# EAGLE design main_v3-bez_dzielnika (EAGLE 5.10)
TME: 1206YC106KAT2A

## Sheet 1 of 5
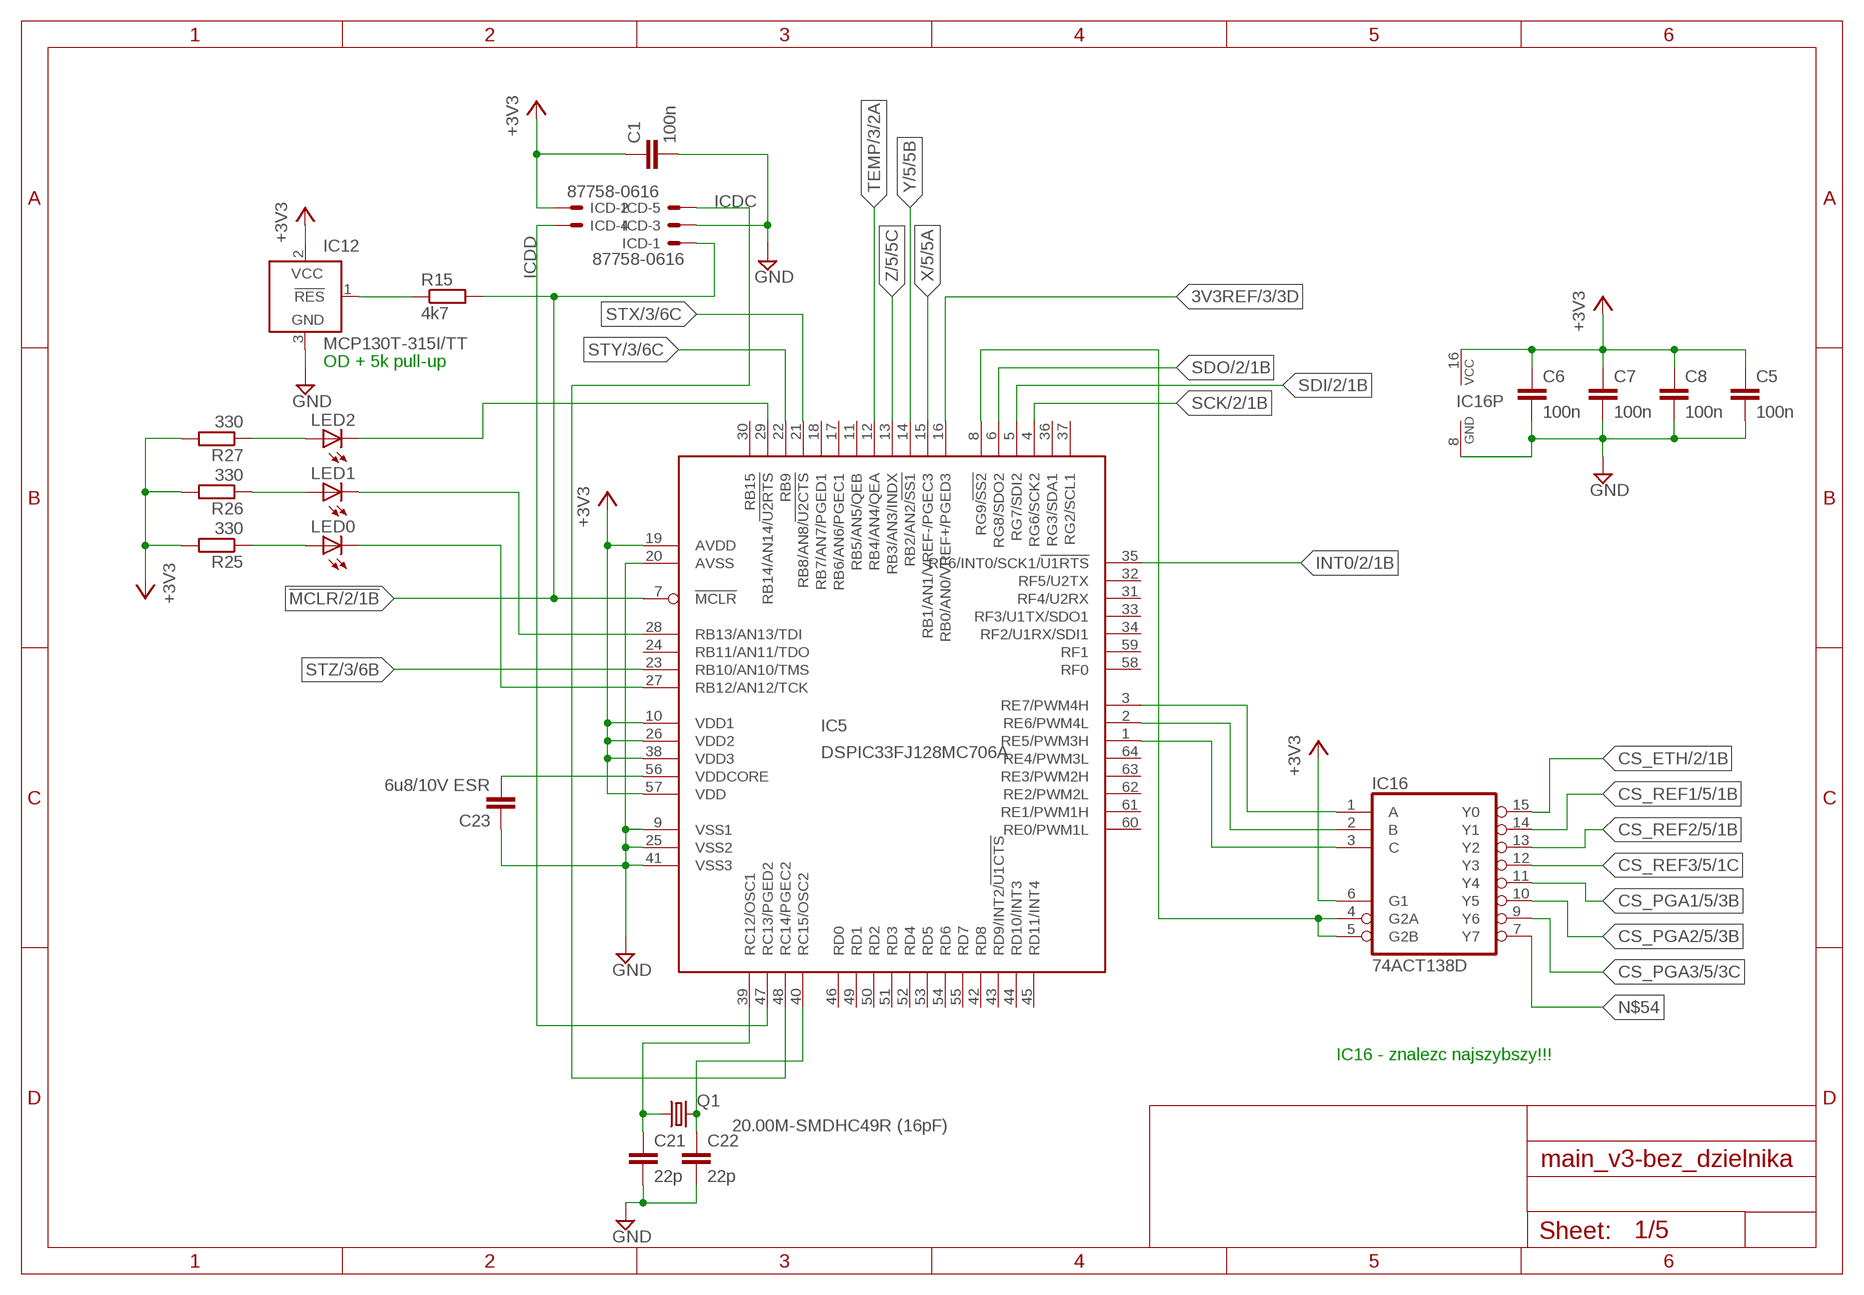
[diagram p0: schematic, sheet 1]

### Parts
C1  100n  C-EUC0805  [C0805]
C5  100n  C-EUC0805  [C0805]
C6  100n  C-EUC0805  [C0805]
C7  100n  C-EUC0805  [C0805]
C8  100n  C-EUC0805  [C0805]
C21  22p  C-EUC0805  [C0805]
C22  22p  C-EUC0805  [C0805]
C23  6u8/10V ESR  C-EUC1210  [C1210]
IC5  DSPIC33FJ128MC706A  DSPIC33FJ128MC706  [TQFP64_10X10]
IC12  MCP130T-315I/TT  MCP10T  [SOT23B-3]
IC16  74ACT138D  [SO16]
ICD  87758-0616  [87758-0616]
LED0  LEDCHIPLED_1206  [CHIPLED_1206]
LED1  LEDCHIPLED_1206  [CHIPLED_1206]
LED2  LEDCHIPLED_1206  [CHIPLED_1206]
Q1  20.00M-SMDHC49R (16pF)  CRYSTALHC49UP  [HC49UP]
R15  4k7  R-EU_R0805  [R0805]
R25  330  R-EU_R0805  [R0805]
R26  330  R-EU_R0805  [R0805]
R27  330  R-EU_R0805  [R0805]

### Nets
3V3REF: IC5.16(RB0/AN0/VREF+/PGED3) ; also sheet 3
!MCLR: IC5.7(!MCLR) ICD.1 R15.2 ; also sheet 2
+3V3: C1.1 C5.1 C6.1 C7.1 C8.1 IC5.10(VDD1) IC5.19(AVDD) IC5.26(VDD2) IC5.38(VDD3) IC5.57(VDD) IC12.2(VCC) IC16.6(G1) IC16.16(VCC) ICD.2 R25.2 R26.2 R27.2 ; also sheet 2,4,5
CS_ETH: IC16.15(Y0) ; also sheet 2
CS_PGA1: IC16.11(Y4) ; also sheet 5
CS_PGA2: IC16.10(Y5) ; also sheet 5
CS_PGA3: IC16.9(Y6) ; also sheet 5
CS_REF1: IC16.14(Y1) ; also sheet 5
CS_REF2: IC16.13(Y2) ; also sheet 5
CS_REF3: IC16.12(Y3) ; also sheet 5
GND: C1.2 C5.2 C6.2 C7.2 C8.2 C21.2 C22.2 C23.1 IC5.9(VSS1) IC5.20(AVSS) IC5.25(VSS2) IC5.41(VSS3) IC12.3(GND) IC16.8(GND) ICD.3 ; also sheet 2,3,4,5
ICDC: IC5.48(RC14/PGEC2) ICD.5
ICDD: IC5.47(RC13/PGED2) ICD.4
INT0: IC5.35(RF6/INT0/SCK1/!U1RTS) ; also sheet 2
LED0: IC5.27(RB12/AN12/TCK) LED0.C
LED1: IC5.28(RB13/AN13/TDI) LED1.C
LED2: IC5.29(RB14/AN14/!U2RTS) LED2.C
N$13: IC5.1(RE5/PWM3H) IC16.3(C)
N$43: IC5.8(RG9/!SS2) IC16.4(G2A) IC16.5(G2B)
N$46: C23.2 IC5.56(VDDCORE)
N$47: IC12.1(!RES) R15.1
N$48: C22.1 IC5.40(RC15/OSC2) Q1.2
N$49: C21.1 IC5.39(RC12/OSC1) Q1.1
N$54: IC16.7(Y7)
N$55: IC5.3(RE7/PWM4H) IC16.1(A)
N$56: IC5.2(RE6/PWM4L) IC16.2(B)
N$60: LED0.A R25.1
N$61: LED1.A R26.1
N$62: LED2.A R27.1
SCK: IC5.4(RG6/SCK2) ; also sheet 2
SDI: IC5.5(RG7/SDI2) ; also sheet 2,5
SDO: IC5.6(RG8/SDO2) ; also sheet 2,5
STX: IC5.21(RB8/AN8/!U2CTS) ; also sheet 3
STY: IC5.22(RB9) ; also sheet 3
STZ: IC5.23(RB10/AN10/TMS) ; also sheet 3
TEMP: IC5.12(RB4/AN4/QEA) ; also sheet 3
X: IC5.15(RB1/AN1/VREF-/PGEC3) ; also sheet 5
Y: IC5.14(RB2/AN2/!SS1) ; also sheet 5
Z: IC5.13(RB3/AN3/INDX) ; also sheet 5
Unconnected: IC5.11(RB5/AN5/QEB) IC5.17(RB6/AN6/PGEC1) IC5.18(RB7/AN7/PGED1) IC5.24(RB11/AN11/TDO) IC5.30(RB15) IC5.31(RF4/U2RX) IC5.32(RF5/U2TX) IC5.33(RF3/U1TX/SDO1) IC5.34(RF2/U1RX/SDI1) IC5.36(RG3/SDA1) IC5.37(RG2/SCL1) IC5.42(RD8) IC5.43(RD9/INT2/!U1CTS) IC5.44(RD10/INT3) IC5.45(RD11/INT4) IC5.46(RD0) IC5.49(RD1) IC5.50(RD2) IC5.51(RD3) IC5.52(RD4) IC5.53(RD5) IC5.54(RD6) IC5.55(RD7) IC5.58(RF0) IC5.59(RF1) IC5.60(RE0/PWM1L) IC5.61(RE1/PWM1H) IC5.62(RE2/PWM2L) IC5.63(RE3/PWM2H) IC5.64(RE4/PWM3L) ICD.6

### Notes on the sheet
- OD + 5k pull-up
- IC16 - znalezc najszybszy!!!

## Sheet 2 of 5
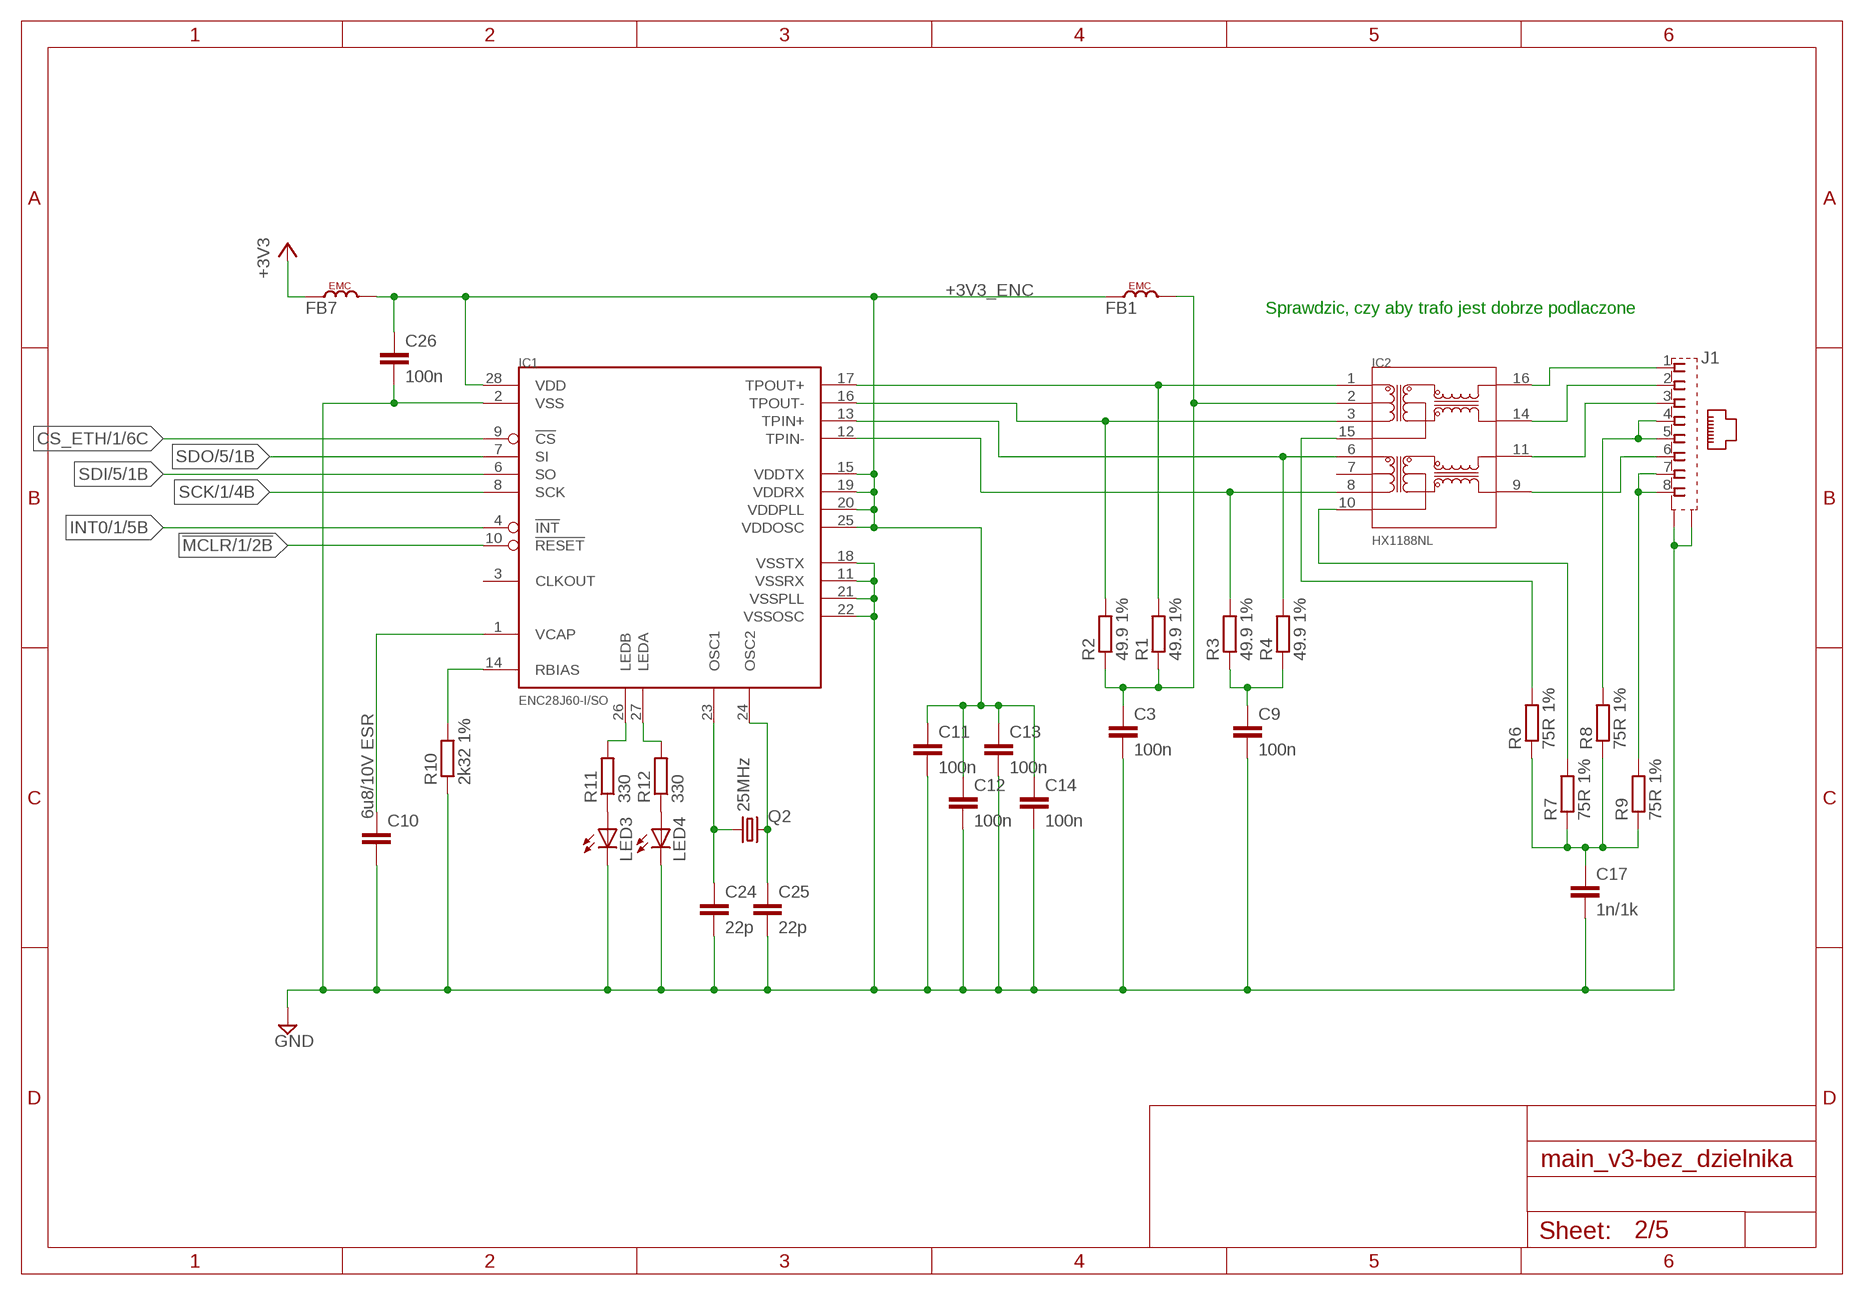
[diagram p1: schematic, sheet 2]

### Parts
C3  100n  C-EUC0805  [C0805]
C9  100n  C-EUC0805  [C0805]
C10  6u8/10V ESR  C-EUC1210  [C1210]
C11  100n  C-EUC0805  [C0805]
C12  100n  C-EUC0805  [C0805]
C13  100n  C-EUC0805  [C0805]
C14  100n  C-EUC0805  [C0805]
C17  1n/1k  C-EUC0805  [C0805]
C24  22p  C-EUC0805  [C0805]
C25  22p  C-EUC0805  [C0805]
C26  100n  C-EUC0805  [C0805]
FB1  FERRITE_BEAD0805  [R0805]
FB7  FERRITE_BEAD0805  [R0805]
IC1  ENC28J60-I/SO  [SO28W]
IC2  HX1188NL  [TRAFO_H*NL]
J1  555153-1  [555153-1]
LED3  LEDCHIPLED_1206  [CHIPLED_1206]
LED4  LEDCHIPLED_1206  [CHIPLED_1206]
Q2  25MHz  CRYSTALHC49UP  [HC49UP]
R1  49.9 1%  R-EU_M0805  [M0805]
R2  49.9 1%  R-EU_M0805  [M0805]
R3  49.9 1%  R-EU_M0805  [M0805]
R4  49.9 1%  R-EU_M0805  [M0805]
R6  75R 1%  R-EU_R0805  [R0805]
R7  75R 1%  R-EU_R0805  [R0805]
R8  75R 1%  R-EU_R0805  [R0805]
R9  75R 1%  R-EU_R0805  [R0805]
R10  2k32 1%  R-EU_0204/5  [0204/5]
R11  330  R-EU_R0805  [R0805]
R12  330  R-EU_R0805  [R0805]

### Nets
!MCLR: IC1.10(!RESET) ; also sheet 1
+3V3: FB7.1 ; also sheet 1,4,5
+3V3_ENC: C11.1 C12.1 C13.1 C14.1 C26.1 FB1.1 FB7.2 IC1.15(VDDTX) IC1.19(VDDRX) IC1.20(VDDPLL) IC1.25(VDDOSC) IC1.28(VDD)
CS_ETH: IC1.9(!CS) ; also sheet 1
GND: C3.2 C9.2 C10.2 C11.2 C12.2 C13.2 C14.2 C17.2 C24.2 C25.2 C26.2 IC1.2(VSS) IC1.11(VSSRX) IC1.18(VSSTX) IC1.21(VSSPLL) IC1.22(VSSOSC) J1.G1(S1) J1.G2(S2) LED3.C LED4.C R10.1 ; also sheet 1,3,4,5
INT0: IC1.4(!INT) ; also sheet 1
N$5: IC2.15 R6.2
N$6: C3.1 FB1.2 IC2.2 R1.1 R2.1
N$7: IC2.10 R7.2
N$8: C9.1 R3.1 R4.1
N$9: C17.1 R6.1 R7.1 R8.1 R9.1
N$14: J1.4 J1.5 R8.2
N$15: J1.7 J1.8 R9.2
N$16: C25.1 IC1.24(OSC2) Q2.2
N$17: C24.1 IC1.23(OSC1) Q2.1
N$18: IC1.14(RBIAS) R10.2
N$19: C10.1 IC1.1(VCAP)
N$22: LED3.A R11.1
N$23: LED4.A R12.1
N$24: IC1.26(LEDB) R11.2
N$25: IC1.27(LEDA) R12.2
SCK: IC1.8(SCK) ; also sheet 1
SDI: IC1.6(SO) ; also sheet 1,5
SDO: IC1.7(SI) ; also sheet 1,5
TPIN+1: IC1.13(TPIN+) IC2.6 R4.2
TPIN+2: IC2.11 J1.3
TPIN-1: IC1.12(TPIN-) IC2.8 R3.2
TPIN-2: IC2.9 J1.6
TPOUT+1: IC1.17(TPOUT+) IC2.1 R1.2
TPOUT+2: IC2.16 J1.1
TPOUT-1: IC1.16(TPOUT-) IC2.3 R2.2
TPOUT-2: IC2.14 J1.2
Unconnected: IC1.3(CLKOUT) IC2.7

### Notes on the sheet
- Sprawdzic, czy aby trafo jest dobrze podlaczone

## Sheet 3 of 5
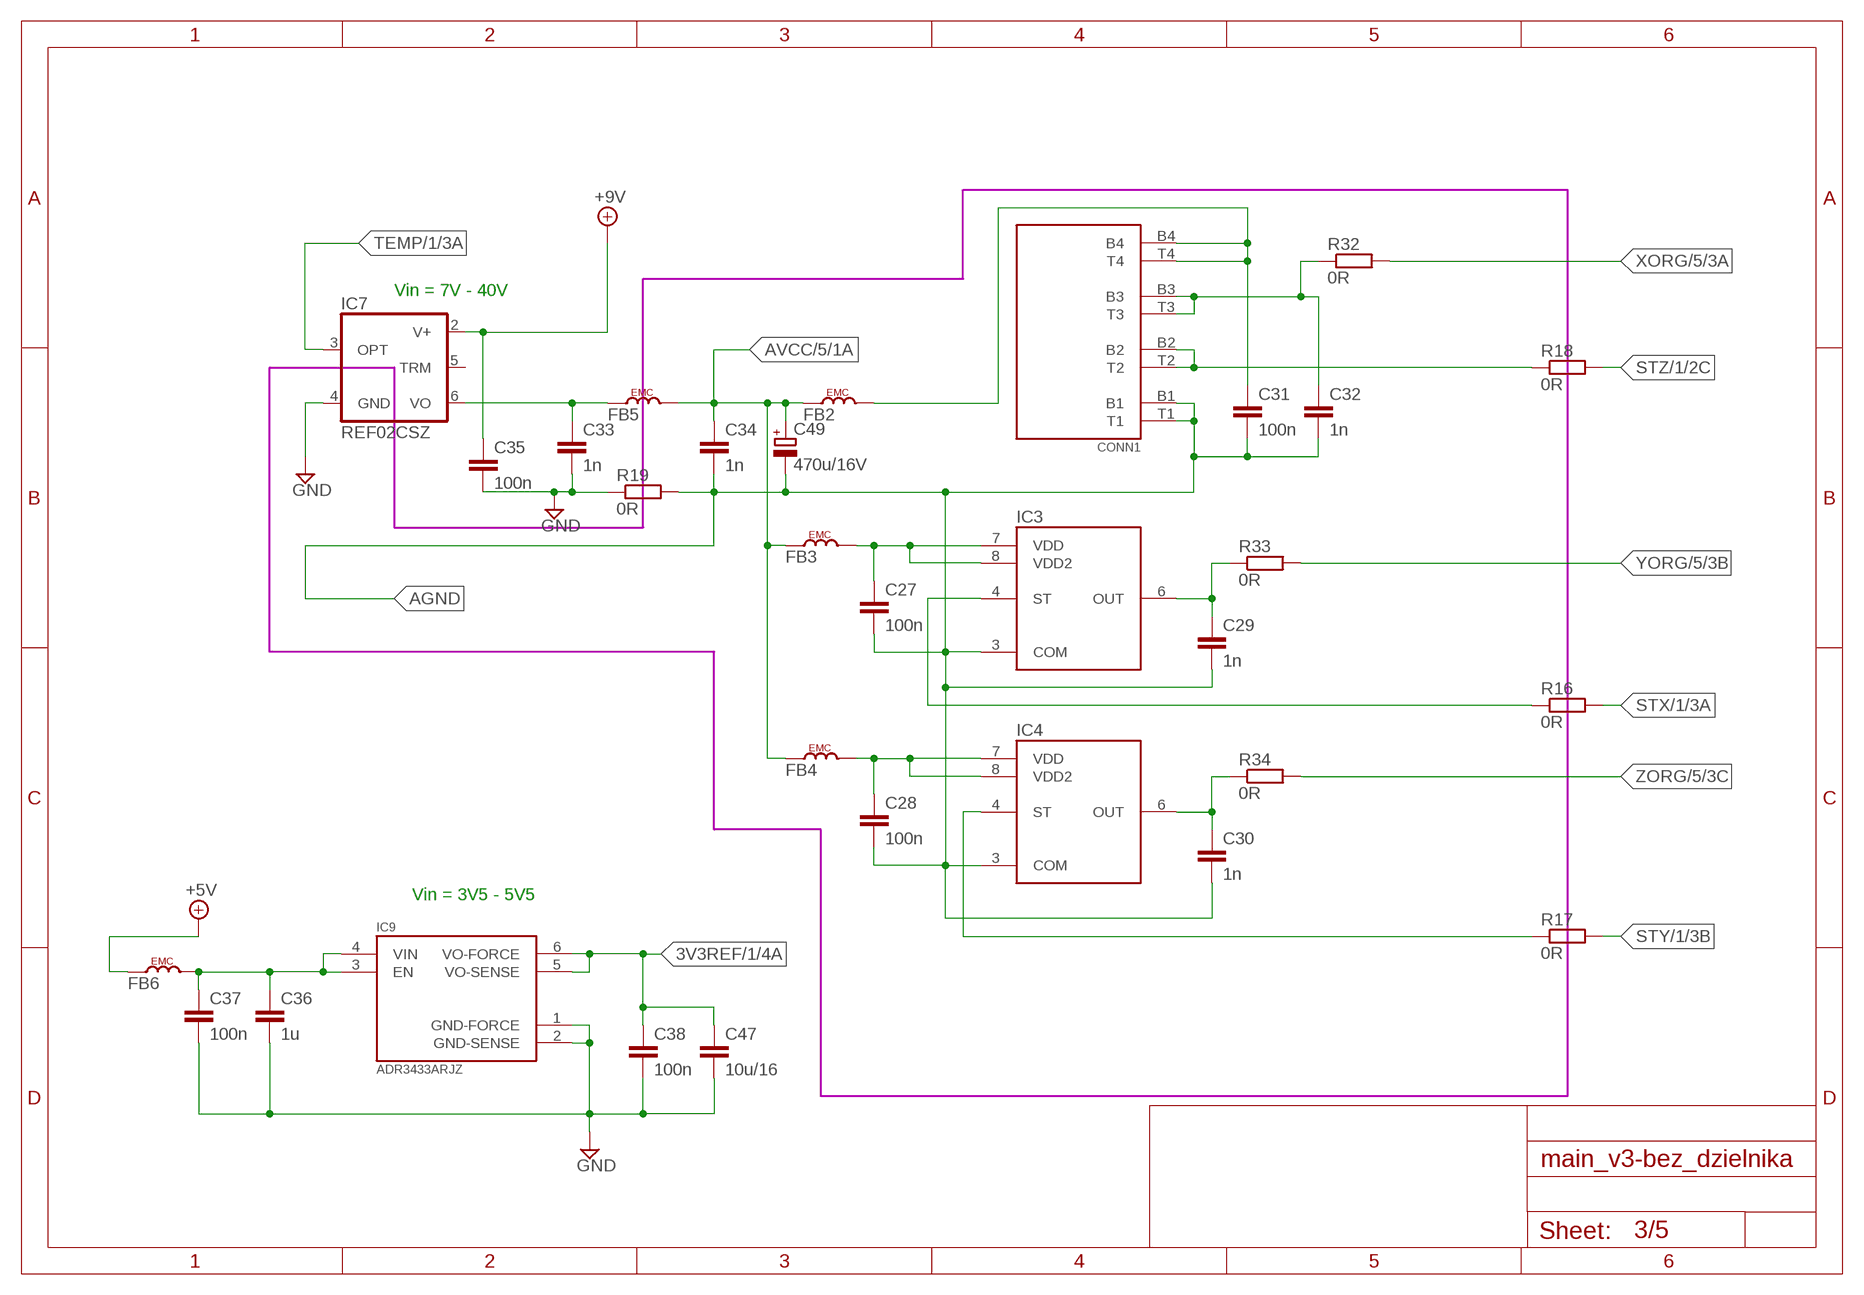
[diagram p2: schematic, sheet 3]

### Parts
C27  100n  C-EUC0805  [C0805]
C28  100n  C-EUC0805  [C0805]
C29  1n  C-EUC0805  [C0805]
C30  1n  C-EUC0805  [C0805]
C31  100n  C-EUC0805  [C0805]
C32  1n  C-EUC0805  [C0805]
C33  1n  C-EUC0805  [C0805]
C34  1n  C-EUC0805  [C0805]
C35  100n  C-EUC0805  [C0805]
C36  1u  C-EUC1206  [C1206]
C37  100n  C-EUC0805  [C0805]
C38  100n  C-EUC0805  [C0805]
C47  10u/16  C-EUC1206K  [C1206K]
C49  470u/16V  CPOL-EUE3.5-8  [E3,5-8]
CONN1  GNIAZDO4  [GNIAZDO]
FB2  FERRITE_BEAD0805  [R0805]
FB3  FERRITE_BEAD0805  [R0805]
FB4  FERRITE_BEAD0805  [R0805]
FB5  FERRITE_BEAD0805  [R0805]
FB6  FERRITE_BEAD0805  [R0805]
IC3  ADXL001-70  [LCC8]
IC4  ADXL001-70  [LCC8]
IC7  REF02CSZ  REF02D  [SO08]
IC9  ADR3433ARJZ  [SOT23-6]
R16  0R  R-EU_R0805  [R0805]
R17  0R  R-EU_R0805  [R0805]
R18  0R  R-EU_R0805  [R0805]
R19  0R  R-EU_R0805  [R0805]
R32  0R  R-EU_R0805  [R0805]
R33  0R  R-EU_R0805  [R0805]
R34  0R  R-EU_R0805  [R0805]

### Nets
3V3REF: C38.1 C47.1 IC9.5(VO-SENSE) IC9.6(VO-FORCE) ; also sheet 1
+5V: FB6.1 ; also sheet 4,5
+9V: C35.1 IC7.2(V+) ; also sheet 4
AGND: C27.2 C28.2 C29.2 C30.2 C31.2 C32.2 C34.2 C49.- CONN1.B1 CONN1.T1 IC3.3(COM) IC4.3(COM) R19.2
AVCC: C34.1 C49.+ FB2.1 FB3.1 FB4.1 FB5.2 ; also sheet 5
GND: C33.2 C35.2 C36.2 C37.2 C38.2 C47.2 IC7.4(GND) IC9.1(GND-FORCE) IC9.2(GND-SENSE) R19.1 ; also sheet 1,2,4,5
N$12: C36.1 C37.1 FB6.2 IC9.3(EN) IC9.4(VIN)
N$21: C27.1 FB3.2 IC3.7(VDD) IC3.8(VDD2)
N$26: C29.1 IC3.6(OUT) R33.1
N$27: C30.1 IC4.6(OUT) R34.1
N$28: CONN1.B2 CONN1.T2 R18.1
N$29: C32.1 CONN1.B3 CONN1.T3 R32.1
N$31: IC3.4(ST) R16.1
N$32: C31.1 CONN1.B4 CONN1.T4 FB2.2
N$33: C28.1 FB4.2 IC4.7(VDD) IC4.8(VDD2)
N$34: C33.1 FB5.1 IC7.6(VO)
N$40: IC4.4(ST) R17.1
STX: R16.2 ; also sheet 1
STY: R17.2 ; also sheet 1
STZ: R18.2 ; also sheet 1
TEMP: IC7.3(OPT) ; also sheet 1
XORG: R32.2 ; also sheet 5
YORG: R33.2 ; also sheet 5
ZORG: R34.2 ; also sheet 5
Unconnected: IC7.5(TRM)

### Notes on the sheet
- Vin = 7V - 40V
- Vin = 3V5 - 5V5

## Sheet 4 of 5
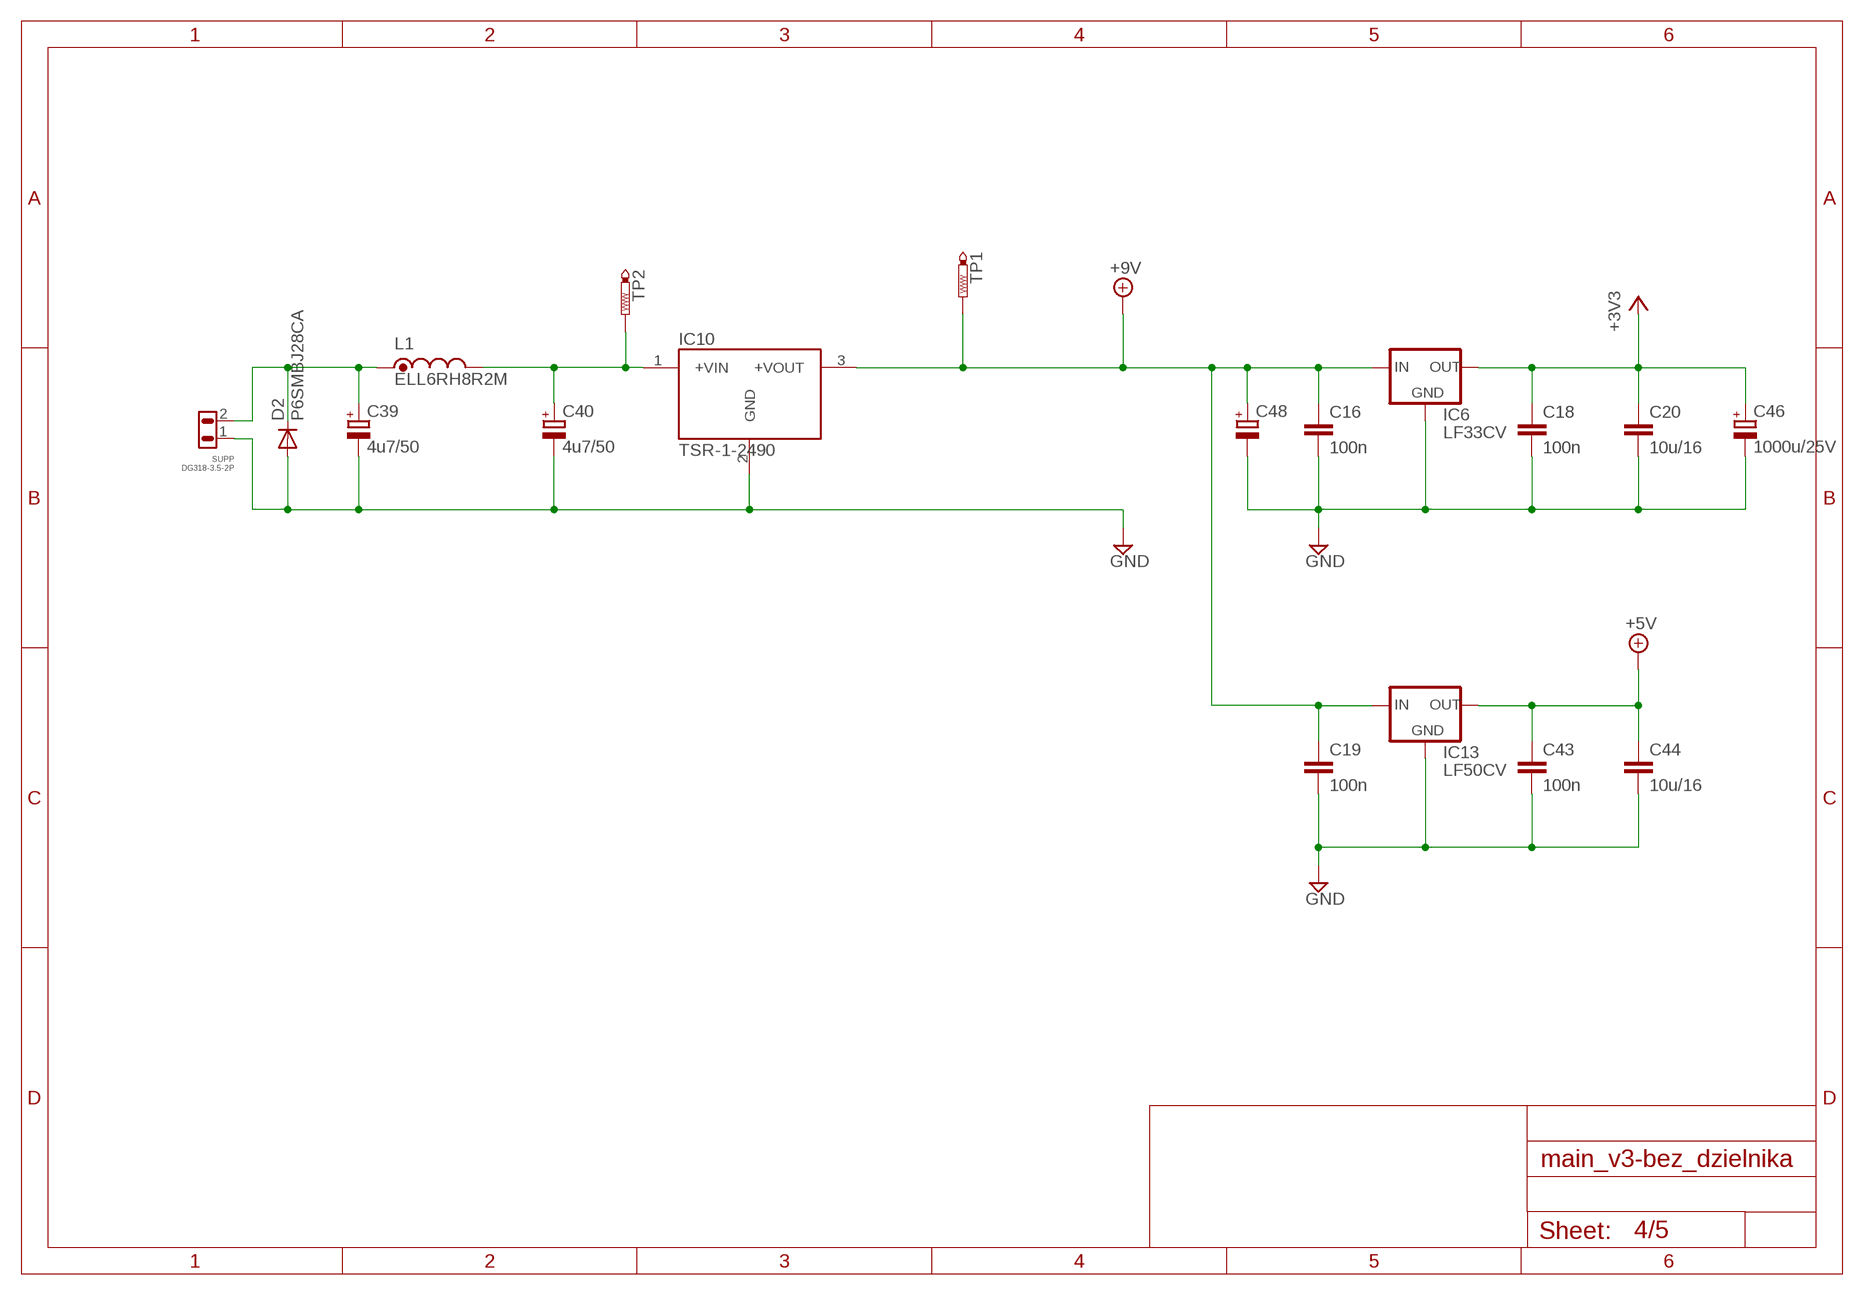
[diagram p3: schematic, sheet 4]

### Parts
C16  100n  C-EUC0805  [C0805]
C18  100n  C-EUC0805  [C0805]
C19  100n  C-EUC0805  [C0805]
C20  10u/16  C-EUC1206K  [C1206K]
C39  4u7/50  CPOL-EUUD-5X5,8  [UD-5X5,8_NICHICON]
C40  4u7/50  CPOL-EUUD-5X5,8  [UD-5X5,8_NICHICON]
C43  100n  C-EUC0805  [C0805]
C44  10u/16  C-EUC1206K  [C1206K]
C46  1000u/25V  CPOL-EUTT5D10  [TT5D10]
C48  CPOL-EUE3.5-8  [E3,5-8]
D2  P6SMBJ28CA  DIODE-DO214AA  [DO214AA]
IC6  LF33CV  78XXS  [78XXS]
IC10  TSR-1-2490  [TSR1]
IC13  LF50CV  78XXS  [78XXS]
L1  ELL6RH8R2M  [L_PKG_60X60]
SUPP  DG318-3.5-2P  [DG381X2-3.5]
TP1  PTR1PAD1-13  [P1-13]
TP2  PTR1PAD1-13  [P1-13]

### Nets
+3V3: C18.1 C20.1 C46.+ IC6.OUT ; also sheet 1,2,5
+5V: C43.1 C44.1 IC13.OUT ; also sheet 3,5
+9V: C16.1 C19.1 C48.+ IC6.IN IC10.3(+VOUT) IC13.IN TP1.TP ; also sheet 3
GND: C16.2 C18.2 C19.2 C20.2 C39.- C40.- C43.2 C44.2 C46.- C48.- D2.A IC6.GND IC10.2(GND) IC13.GND SUPP.1 ; also sheet 1,2,3,5
N$35: C40.+ IC10.1(+VIN) L1.2(OUT) TP2.TP
N$41: C39.+ D2.C L1.1(IN) SUPP.2

## Sheet 5 of 5
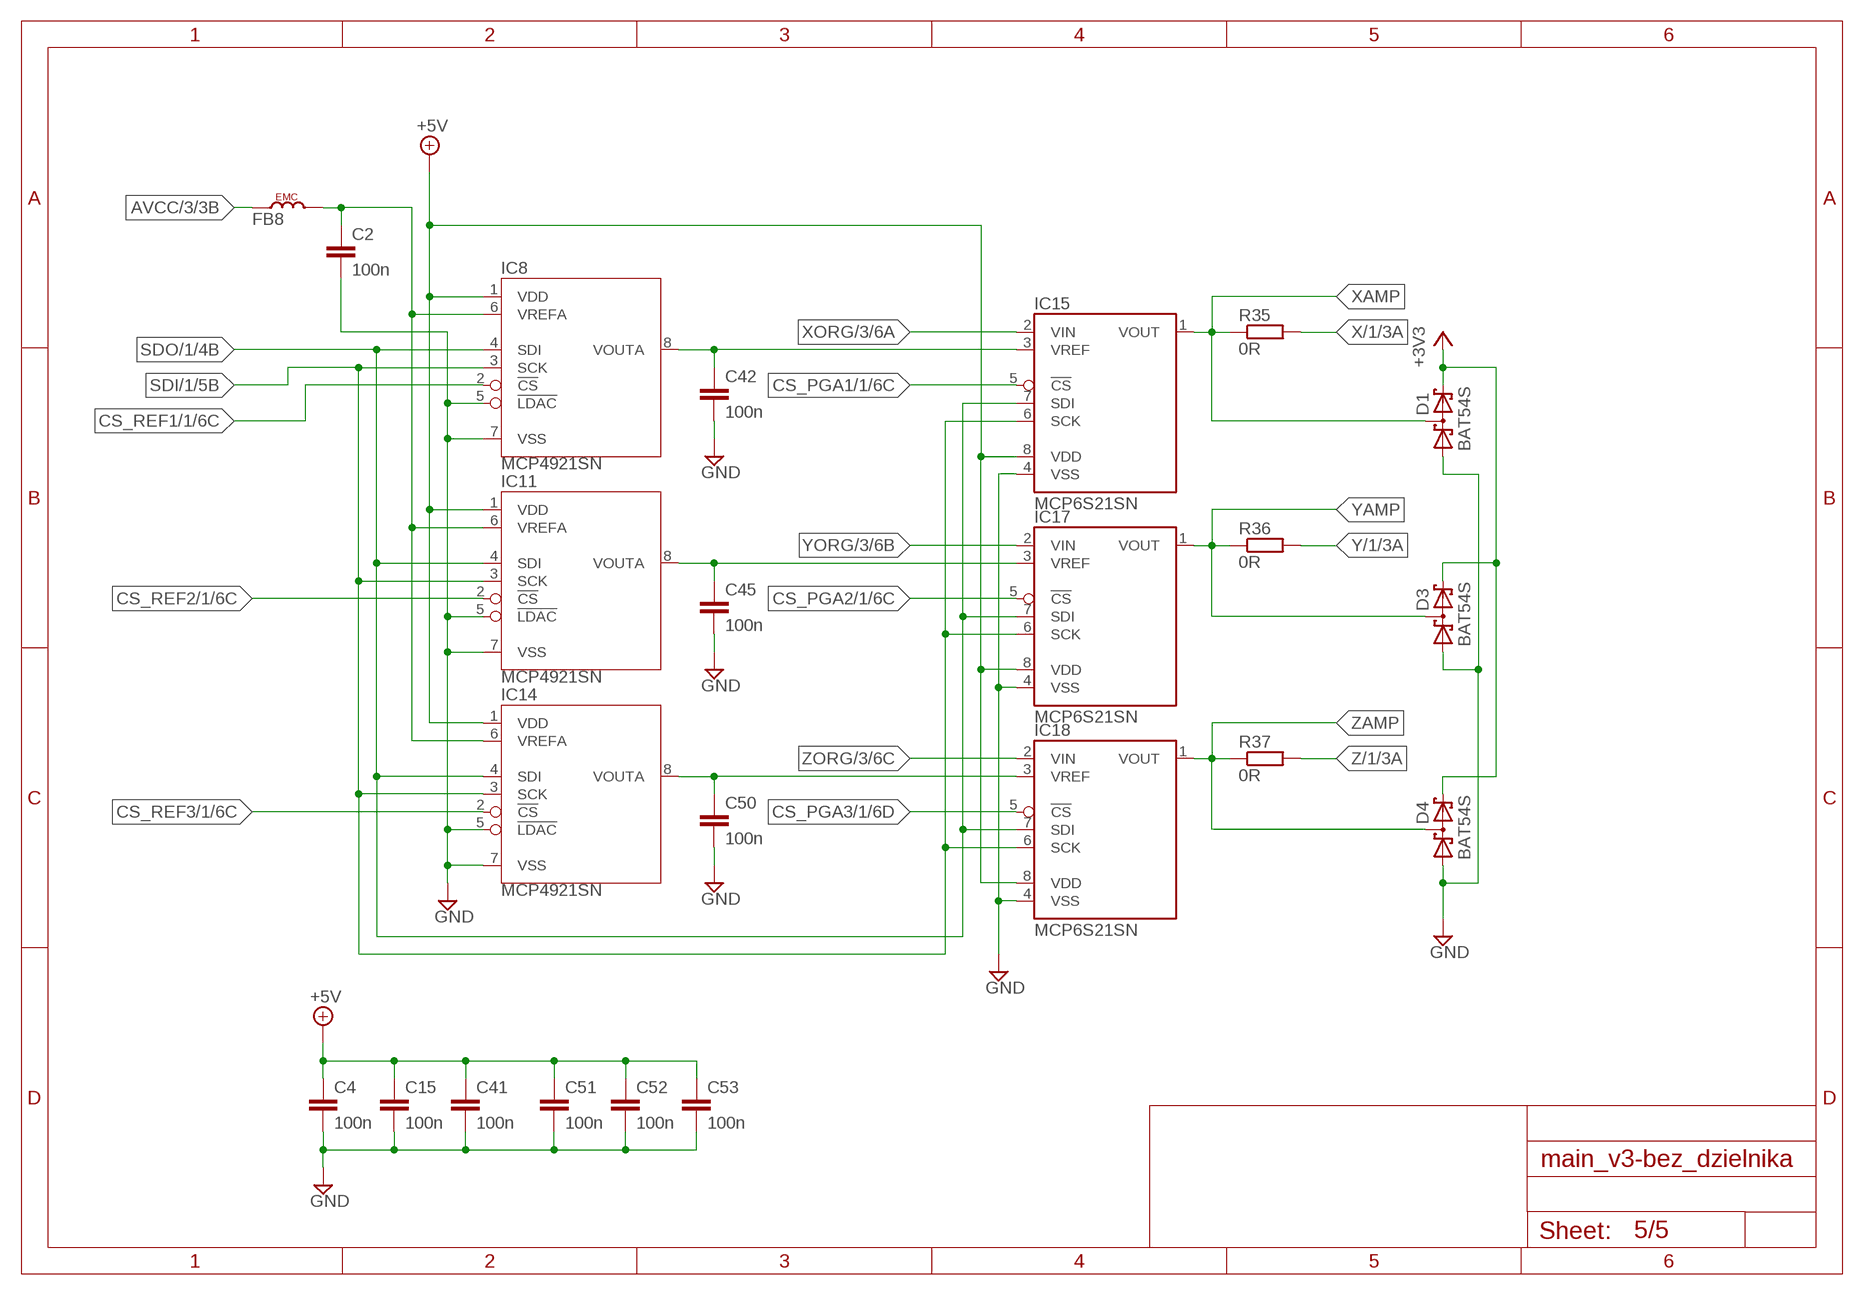
[diagram p4: schematic, sheet 5]

### Parts
C2  100n  C-EUC0805  [C0805]
C4  100n  C-EUC0805  [C0805]
C15  100n  C-EUC0805  [C0805]
C41  100n  C-EUC0805  [C0805]
C42  100n  C-EUC0805  [C0805]
C45  100n  C-EUC0805  [C0805]
C50  100n  C-EUC0805  [C0805]
C51  100n  C-EUC0805  [C0805]
C52  100n  C-EUC0805  [C0805]
C53  100n  C-EUC0805  [C0805]
D1  BAT54S  [SOT23]
D3  BAT54S  [SOT23]
D4  BAT54S  [SOT23]
FB8  FERRITE_BEAD0805  [R0805]
IC8  MCP4921SN  [SO-08]
IC11  MCP4921SN  [SO-08]
IC14  MCP4921SN  [SO-08]
IC15  MCP6S21SN  [SOIC8]
IC17  MCP6S21SN  [SOIC8]
IC18  MCP6S21SN  [SOIC8]
R35  0R  R-EU_M0805  [M0805]
R36  0R  R-EU_M0805  [M0805]
R37  0R  R-EU_M0805  [M0805]

### Nets
+3V3: D1.3(C2) D3.3(C2) D4.3(C2) ; also sheet 1,2,4
+5V: C4.1 C15.1 C41.1 C51.1 C52.1 C53.1 IC8.1(VDD) IC11.1(VDD) IC14.1(VDD) IC15.8(VDD) IC17.8(VDD) IC18.8(VDD) ; also sheet 3,4
AVCC: FB8.1 ; also sheet 3
CS_PGA1: IC15.5(!CS) ; also sheet 1
CS_PGA2: IC17.5(!CS) ; also sheet 1
CS_PGA3: IC18.5(!CS) ; also sheet 1
CS_REF1: IC8.2(!CS) ; also sheet 1
CS_REF2: IC11.2(!CS) ; also sheet 1
CS_REF3: IC14.2(!CS) ; also sheet 1
GND: C2.2 C4.2 C15.2 C41.2 C42.2 C45.2 C50.2 C51.2 C52.2 C53.2 D1.1(A1) D3.1(A1) D4.1(A1) IC8.5(!LDAC) IC8.7(VSS) IC11.5(!LDAC) IC11.7(VSS) IC14.5(!LDAC) IC14.7(VSS) ; also sheet 1,2,3,4
N$1: C42.1 IC8.8(VOUTA) IC15.3(VREF)
N$2: C45.1 IC11.8(VOUTA) IC17.3(VREF)
N$11: C2.1 FB8.2 IC8.6(VREFA) IC11.6(VREFA) IC14.6(VREFA)
N$20: C50.1 IC14.8(VOUTA) IC18.3(VREF)
N$30: IC15.4(VSS) IC17.4(VSS) IC18.4(VSS) ; supply symbol labelled GND
SDI: IC8.3(SCK) IC11.3(SCK) IC14.3(SCK) IC15.6(SCK) IC17.6(SCK) IC18.6(SCK) ; also sheet 1,2
SDO: IC8.4(SDI) IC11.4(SDI) IC14.4(SDI) IC15.7(SDI) IC17.7(SDI) IC18.7(SDI) ; also sheet 1,2
X: R35.2 ; also sheet 1
XAMP: D1.2(C1A2) IC15.1(VOUT) R35.1
XORG: IC15.2(VIN) ; also sheet 3
Y: R36.2 ; also sheet 1
YAMP: D3.2(C1A2) IC17.1(VOUT) R36.1
YORG: IC17.2(VIN) ; also sheet 3
Z: R37.2 ; also sheet 1
ZAMP: D4.2(C1A2) IC18.1(VOUT) R37.1
ZORG: IC18.2(VIN) ; also sheet 3

## Library data of the parts
C1-C38 C41-C45 C47 C50-C53 = rcl:C-EU: CAPACITOR, European symbol
C39 C40 C46 C48 C49 = rcl:CPOL-EU: POLARIZED CAPACITOR, European symbol
CONN1 = mechanika:GNIAZDO4
D1 D3 D4 = diode:BAT54S: Schottky Diodes Source: Fairchild .. BAT54.pdf
D2 = diode:DIODE-: DIODE
FB1-FB8 = passives:FERRITE_BEAD
IC1 = lib1:ENC28J60
IC2 = lib1:HX1188NL
IC3 IC4 = lib1:ADXL001
IC5 = lib1:DSPIC33FJ128MC706: DSPIC33FJ128MC706 edit this description Auto generated by make-symbol-device-package-bsdl.ulp Rev. 34 Source: DSPIC33FJ128MC706.bsdl
IC6 IC13 = v-reg:78XXS: VOLTAGE REGULATOR
IC7 = linear:REF02: VOLTAGE REFERENCE
IC8 IC11 IC14 = moje:MCP4921
IC9 = lib1:ADR3433ARJZ
IC10 = lib1:TSR-1-2490
IC12 = lib1:MCP1*0T: POWER SUPPLY MONITOR replacement for Maxim MAX809 and MAX810
IC15 IC17 IC18 = lib1:MCP6S21
IC16 = 74xx-eu:74*138: 3-line to 8-line DECODER/DEMULTIPLEXER
ICD = con-molex:87758-0616: 6 Pin - 2mm Dual Row Single Wafer, Vertical T/H HDR Source: http://www.molex.com/pdm_docs/sd/877580616_sd.pdf
J1 = con-amp:555153-1: AMP connector
L1 = lib1:ELL6RH8R2M
LED0 LED1-LED4 = led:LED: LED OSRAM: - CHIPLED LG R971, LG N971, LY N971, LG Q971, LY Q971, LO R971, LY R971 LH N974, LH R974 LS Q976, LO Q976, LY Q976 LO Q996 - Hyper CHIPLED LW Q18S LB Q993, LB Q99A, LB R99A - SideLED LS A670, LO A670, LY A670, LG A670, LP A670 LB A673, LV A673, LT A673, LW A673 LH A674 LY A675 LS A676, LA A676, LO A676, LY A676, LW A676 LS A679, LY A679, LG A679 - Hyper Micro SIDELED® LS Y876, LA Y876, LO Y876, LY Y876 LT Y87S - SmartLED LW L88C, LW L88S LB L89C, LB L89S, LG L890 LS L89K, LO L89K, LY L89K LS L896, LA L896, LO L896, LY L896 - TOPLED LS T670, LO T670, LY T670, LG T670, LP T670 LSG T670, LSP T670, LSY T670, LOP T670, LYG T670 LG T671, LOG T671, LSG T671 LB T673, LV T673, LT T673, LW T673 LH T674 LS T676, LA T676, LO T676, LY T676, LB T676, LH T676, LSB T676, LW T676 LB T67C, LV T67C, LT T67C, LS T67K, LO T67K, LY T67K, LW E67C LS E67B, LA E67B, LO E67B, LY E67B, LB E67C, LV E67C, LT E67C LW T67C LS T679, LY T679, LG T679 LS T770, LO T770, LY T770, LG T770, LP T770 LB T773, LV T773, LT T773, LW T773 LH T774 LS E675, LA E675, LY E675, LS T675 LS T776, LA T776, LO T776, LY T776, LB T776 LHGB T686 LT T68C, LB T68C - Hyper Mini TOPLED® LB M676 - Mini TOPLED Santana® LG M470 LS M47K, LO M47K, LY M47K Source: http://www.osram.convergy.de LUXEON: - LUMILED® LXK2-PW12-R00, LXK2-PW12-S00, LXK2-PW14-U00, LXK2-PW14-V00 LXK2-PM12-R00, LXK2-PM12-S00, LXK2-PM14-U00 LXK2-PE12-Q00, LXK2-PE12-R00, LXK2-PE12-S00, LXK2-PE14-T00, LXK2-PE14-U00 LXK2-PB12-K00, LXK2-PB12-L00, LXK2-PB12-M00, LXK2-PB14-N00, LXK2-PB14-P00, LXK2-PB14-Q00 LXK2-PR12-L00, LXK2-PR12-M00, LXK2-PR14-Q00, LXK2-PR14-R00 LXK2-PD12-Q00, LXK2-PD12-R00, LXK2-PD12-S00 LXK2-PH12-R00, LXK2-PH12-S00 LXK2-PL12-P00, LXK2-PL12-Q00, LXK2-PL12-R00 Source: www.luxeon.com KINGBRIGHT: KA-3528ASYC Source: www.kingbright.com
Q1 Q2 = crystal:CRYSTAL: CRYSTAL
R1-R4 R6-R12 R15-R19 R25-R27 R32-R37 = rcl:R-EU_: RESISTOR, European symbol
SUPP = connectors:DG318-3.5-2P
TP1 TP2 = testpad:PTR1: TEST PIN

## Board
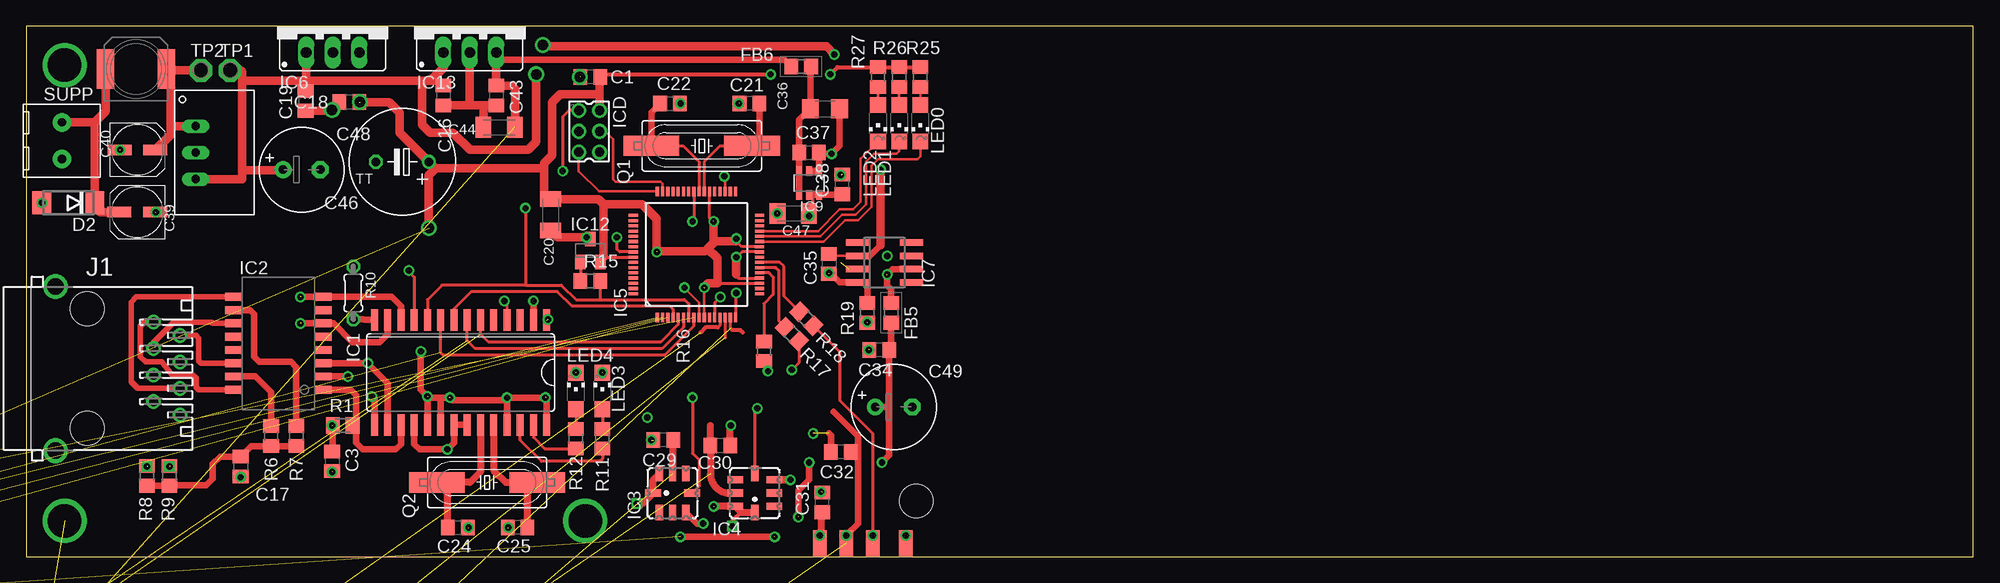
[diagram p5: board, top side]
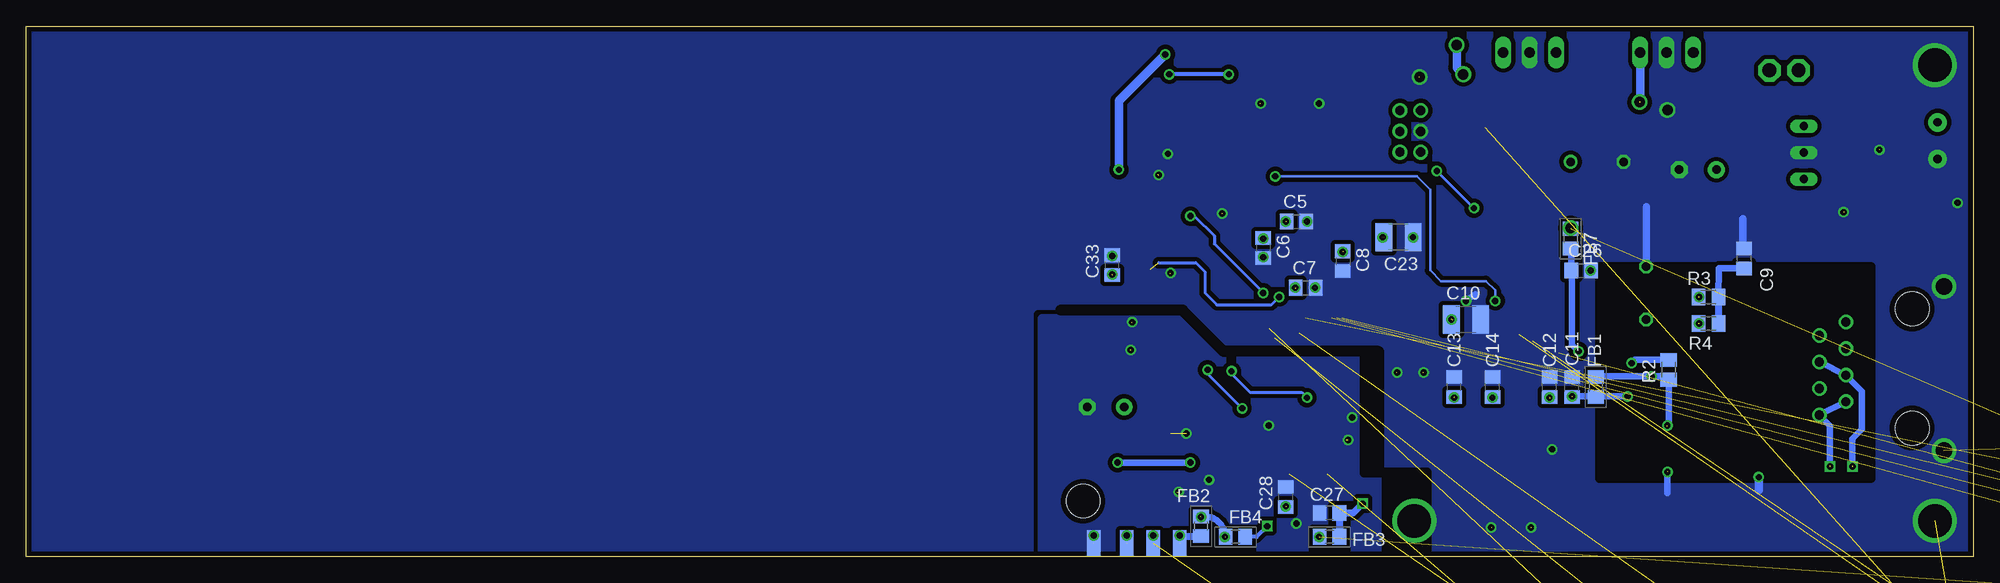
[diagram p6: board, bottom side, seen from below]

Size 186.67 x 50.85 mm. Coordinates in mm from the lower left corner, seen from the top.
Outline: 0,0 186.67,0 186.67,50.85 0,50.85 0,0
Copper layers (1*16): Top 0.035mm / dielectric 1.5mm / Bottom 0.035mm
Design rules "drukowane.pl *": minimum track width 8mil, minimum drill 16mil, track to track 8mil, track to pad 8mil, pad to pad 8mil, via to via 8mil, smd to smd 0mil, copper to edge 20mil, drill to drill 8mil, minimum pad ring 10mil, minimum via ring 8mil, stop-mask expansion 4mil, vias tented up to drill 0mil, thermal gap 10mil
Holes 3.2 mm at 85.34,5.33
bRestrict: area 9.8,7.5 to 35.8,27.8; area 56.9,8 to 58.4,19.4; area 52.3,-1.5 to 56.1,8.1; 3 lines

### Footprints (pad centres in the part's own frame; a part is rotated, then mirrored left to right if it is on the bottom)
C0805 = smd 1.3 x 1.5: 1 -0.95,0; 2 0.95,0
C1210 = smd 1.6 x 2.7: 1 -1.4,0; 2 1.4,0
C1206K = smd 1.5 x 2: 1 -1.5,0; 2 1.5,0
C1206 = smd 1.6 x 1.8: 1 -1.4,0; 2 1.4,0
UD-5X5,8_NICHICON = smd 2.3 x 1: + 1.725,0; - -1.7,0
TT5D10 = drill 0.813 round: + -2.54,0 | drill 0.813 octagon: - 2.54,0
E3,5-8 = drill 0.813 pad 1.6 round: + -1.778,0 | drill 0.813 pad 1.6 octagon: - 1.778,0
GNIAZDO = smd 2.54 x 1.27 bottom: B1 0,4.445; B2 0,1.27; B3 0,-1.27; B4 0,-3.81 | smd 2.54 x 1.27: T1 0,4.445; T2 0,1.27; T3 0,-1.27; T4 0,-3.81
SOT23 = smd 1 x 1.4: 1 -0.95,-1.1; 2 0.95,-1.1; 3 0,1.1
DO214AA = smd 1.8 x 2.2: A 2.55,0; C -2.55,0
R0805 = smd 1.3 x 1.5: 1 -0.95,0; 2 0.95,0
SO28W = smd 0.66 x 2.032: 1 -8.255,-5.029; 2 -6.985,-5.029; 3 -5.715,-5.029; 4 -4.445,-5.029; 5 -3.175,-5.029; 6 -1.905,-5.029; 7 -0.635,-5.029; 8 0.635,-5.029; 9 1.905,-5.029; 10 3.175,-5.029; 11 4.445,-5.029; 12 5.715,-5.029; 13 6.985,-5.029; 14 8.255,-5.029; 15 8.255,5.029; 16 6.985,5.029; 17 5.715,5.029; 18 4.445,5.029; 19 3.175,5.029; 20 1.905,5.029; 21 0.635,5.029; 22 -0.635,5.029; 23 -1.905,5.029; 24 -3.175,5.029; 25 -4.445,5.029; 26 -5.715,5.029; 27 -6.985,5.029; 28 -8.255,5.029
TRAFO_H*NL = smd 0.76 x 1.67: 1 -4.445,-4.445; 2 -3.175,-4.445; 3 -1.905,-4.445; 4 -0.635,-4.445; 5 0.635,-4.445; 6 1.905,-4.445; 7 3.175,-4.445; 8 4.445,-4.445; 9 4.445,4.089; 10 3.175,4.089; 11 1.905,4.089; 12 0.635,4.089; 13 -0.635,4.089; 14 -1.905,4.089; 15 -3.175,4.089; 16 -4.445,4.089
LCC8 = smd 1.5 x 0.7: 1 -1.867,1.27; 2 -1.867,0; 3 -1.867,-1.27; 5 1.867,-1.27; 6 1.867,0; 7 1.867,1.27 | smd 0.7 x 1.5: 4 0,-1.867; 8 0,1.867
TQFP64_10X10 = smd 0.9 x 0.3: 1 -6.05,3.75; 2 -6.05,3.25; 3 -6.05,2.75; 4 -6.05,2.25; 5 -6.05,1.75; 6 -6.05,1.25; 7 -6.05,0.75; 8 -6.05,0.25; 9 -6.05,-0.25; 10 -6.05,-0.75; 11 -6.05,-1.25; 12 -6.05,-1.75; 13 -6.05,-2.25; 14 -6.05,-2.75; 15 -6.05,-3.25; 16 -6.05,-3.75; 33 6.05,-3.75; 34 6.05,-3.25; 35 6.05,-2.75; 36 6.05,-2.25; 37 6.05,-1.75; 38 6.05,-1.25; 39 6.05,-0.75; 40 6.05,-0.25; 41 6.05,0.25; 42 6.05,0.75; 43 6.05,1.25; 44 6.05,1.75; 45 6.05,2.25; 46 6.05,2.75; 47 6.05,3.25; 48 6.05,3.75 | smd 0.3 x 0.9: 17 -3.75,-6.05; 18 -3.25,-6.05; 19 -2.75,-6.05; 20 -2.25,-6.05; 21 -1.75,-6.05; 22 -1.25,-6.05; 23 -0.75,-6.05; 24 -0.25,-6.05; 25 0.25,-6.05; 26 0.75,-6.05; 27 1.25,-6.05; 28 1.75,-6.05; 29 2.25,-6.05; 30 2.75,-6.05; 31 3.25,-6.05; 32 3.75,-6.05; 49 3.75,6.05; 50 3.25,6.05; 51 2.75,6.05; 52 2.25,6.05; 53 1.75,6.05; 54 1.25,6.05; 55 0.75,6.05; 56 0.25,6.05; 57 -0.25,6.05; 58 -0.75,6.05; 59 -1.25,6.05; 60 -1.75,6.05; 61 -2.25,6.05; 62 -2.75,6.05; 63 -3.25,6.05; 64 -3.75,6.05
78XXS = drill 1.016 long: GND 0,-2.54; IN -2.54,-2.54; OUT 2.54,-2.54
SO08 = smd 0.6 x 2.2: 1 -1.905,-2.6; 2 -0.635,-2.6; 3 0.635,-2.6; 4 1.905,-2.6; 5 1.905,2.6; 6 0.635,2.6; 7 -0.635,2.6; 8 -1.905,2.6
SO-08 = smd 0.6 x 2.2: 1 -0.635,-2.6; 2 0.635,-2.6; 3 1.905,-2.6; 4 3.175,-2.6; 5 3.175,2.6; 6 1.905,2.6; 7 0.635,2.6; 8 -0.635,2.6
SOT23-6 = smd 0.6 x 0.9: 1 -0.95,-1.15; 2 0,-1.15; 3 0.95,-1.15; 4 0.95,1.15; 5 0,1.15; 6 -0.95,1.15
TSR1 = drill 0.8 long: 1 2.54,0; 2 0,0; 3 -2.54,0
SOT23B-3 = smd 1 x 1.4: 1 -0.95,-1.1; 2 0.95,-1.1; 3 0,1.1
SOIC8 = smd 0.6 x 2.2: 1 -1.905,-2.6; 2 -0.635,-2.6; 3 0.635,-2.6; 4 1.905,-2.6; 5 1.905,2.6; 6 0.635,2.6; 7 -0.635,2.6; 8 -1.905,2.6
SO16 = smd 0.66 x 2.032: 1 -4.445,-3.073; 2 -3.175,-3.073; 3 -1.905,-3.073; 4 -0.635,-3.073; 5 0.635,-3.073; 6 1.905,-3.073; 7 3.175,-3.073; 8 4.445,-3.073; 9 4.445,3.073; 10 3.175,3.073; 11 1.905,3.073; 12 0.635,3.073; 13 -0.635,3.073; 14 -1.905,3.073; 15 -3.175,3.073; 16 -4.445,3.073
87758-0616 = drill 0.9 pad 1.27 round: 1 -2,-1; 2 -2,1; 3 0,-1; 4 0,1; 5 2,-1; 6 2,1
555153-1 = drill 0.889 round: 1 -4.445,6.35; 2 -3.175,8.89; 3 -1.905,6.35; 4 -0.635,8.89; 5 0.635,6.35; 6 1.905,8.89; 7 3.175,6.35; 8 4.445,8.89 | drill 1.575 pad 2.184 round: G1 -7.874,-3.048; G2 7.874,-3.048 | hole 3.251: -5.715,0; 5.715,0
L_PKG_60X60 = smd 1.7 x 3.8: 1 -2.921,0; 2 2.921,0
CHIPLED_1206 = smd 1.5 x 1.5: A 0,-1.75; C 0,1.75
HC49UP = smd 5.334 x 1.93: 1 -4.826,0; 2 4.826,0
M0805 = smd 1.3 x 1.6: 1 -0.95,0; 2 0.95,0
0204/5 = drill 0.813 octagon: 1 -2.54,0; 2 2.54,0
DG381X2-3.5 = drill 0.8 pad 1.778 round: 1 -1.75,0; 2 1.75,0
P1-13 = drill 1.321 pad 2.159 octagon: TP 0,0

### Placement (x,y rotation side)
C1  54.1,45.97 180 top
C2  -35.69,-1.02 0 top  (outside the outline)
C3  29.34,9.14 270 top
C4  -0.38,-17.14 0 top  (outside the outline)
C5  64.9,32.13 0 bottom
C6  68.07,29.59 270 bottom
C7  64.01,25.78 0 bottom
C8  60.45,28.32 270 bottom
C9  21.97,28.57 90 bottom
C10  48.64,22.73 0 bottom
C11  38.48,16.26 90 bottom
C12  40.64,16.26 90 bottom
C13  49.78,16.26 90 bottom
C14  46.1,16.26 90 bottom
C15  -12.19,-17.78 0 top  (outside the outline)
C16  40.01,44.2 270 top
C17  20.57,8.64 270 top
C18  30.99,43.56 180 top
C19  26.8,43.69 270 top
C20  50.29,32.77 270 top
C21  69.34,43.43 180 top
C22  61.72,43.43 0 top
C23  55.12,30.61 180 bottom
C24  41.4,2.79 0 top
C25  47.12,2.79 180 top
C26  37.59,27.43 0 bottom
C27  61.72,4.19 180 bottom
C28  65.91,5.71 90 bottom
C29  61.09,11.18 180 top
C30  66.55,10.67 0 top
C31  76.33,5.21 90 top
C32  78.11,10.03 180 top
C33  82.55,27.94 90 bottom
C34  81.79,19.81 180 top
C35  76.96,28.07 270 top
C36  76.58,42.93 0 top
C37  75.06,38.73 0 top
C38  78.23,35.69 90 top
C39  10.67,33.02 180 top
C40  10.67,38.99 0 top
C41  -22.1,-18.03 0 top  (outside the outline)
C42  -0.25,-21.21 0 top  (outside the outline)
C43  45.09,44.2 270 top
C44  45.34,41.15 180 top
C45  -11.3,-22.35 0 top  (outside the outline)
C46  36.07,37.85 180 top
C47  73.53,32.89 180 top
C48  26.42,37.08 0 top
C49  83.19,14.35 0 top
C50  -22.1,-22.73 0 top  (outside the outline)
C51  0.89,-34.04 0 top  (outside the outline)
C52  -11.43,-34.16 0 top  (outside the outline)
C53  -24.13,-33.4 0 top  (outside the outline)
CONN1  79.88,1.27 270 top
D1  1.14,-45.34 0 top  (outside the outline)
D2  4.06,33.91 180 top
D3  -11.43,-45.59 0 top  (outside the outline)
D4  -25.15,-44.96 0 top  (outside the outline)
FB1  36.2,16.26 90 bottom
FB2  74.04,2.92 270 bottom
FB3  61.72,1.91 0 bottom
FB4  70.74,1.91 0 bottom
FB5  82.93,23.37 270 top
FB6  74.3,46.99 0 top
FB7  38.61,30.48 270 bottom
FB8  -35.18,-4.83 0 top  (outside the outline)
IC1  41.66,17.65 180 top
IC2  24,20.45 90 top
IC3  61.98,6.1 90 top
IC4  69.85,6.1 180 top
IC5  64.26,28.96 90 top
IC6  29.39,50.87 0 top
IC7  82.3,28.19 270 top
IC8  1.27,-11.81 180 top  (outside the outline)
IC9  75.06,35.81 180 top
IC10  16.26,38.73 90 top
IC11  -10.8,-12.32 180 top  (outside the outline)
IC12  54.1,29.34 0 top
IC13  42.54,50.87 0 top
IC14  -21.21,-11.94 180 top  (outside the outline)
IC15  0.89,-29.72 0 top  (outside the outline)
IC16  -18.29,6.22 90 top  (outside the outline)
IC17  -11.56,-29.59 0 top  (outside the outline)
IC18  -23.11,-29.97 0 top  (outside the outline)
ICD  53.98,40.77 270 top
J1  5.87,18.03 270 top
L1  10.54,46.74 0 top
LED0  85.73,41.53 180 top
LED1  83.69,41.53 180 top
LED2  81.66,41.53 180 top
LED3  55.25,15.88 0 top
LED4  52.71,15.88 0 top
Q1  64.77,39.37 180 top
Q2  44.2,7.11 0 top
R1  30.35,12.57 0 top
R2  29.21,17.91 90 bottom
R3  25.4,24.89 180 bottom
R4  25.4,22.35 180 bottom
R6  23.5,11.56 90 top
R7  25.91,11.56 90 top
R8  11.59,7.75 90 top
R9  13.75,7.75 90 top
R10  31.37,25.27 270 top
R11  55.25,11.3 270 top
R12  52.71,11.3 270 top
R15  54.1,26.42 0 top
R16  70.74,19.68 90 top
R17  73.41,21.34 135 top
R18  74.8,22.81 135 top
R19  80.65,23.37 270 top
R25  85.73,45.97 90 top
R26  83.69,45.97 90 top
R27  81.66,45.97 90 top
R32  0.38,-53.59 0 top  (outside the outline)
R33  -11.05,-55.37 0 top  (outside the outline)
R34  -23.75,-53.98 0 top  (outside the outline)
R35  -0.13,-40.64 0 top  (outside the outline)
R36  -11.56,-40.89 0 top  (outside the outline)
R37  -24.89,-40.89 0 top  (outside the outline)
SUPP  3.43,39.88 90 top
TP1  19.56,46.61 0 top
TP2  16.76,46.61 0 top

### Tracks (layer width: path | path; a pad name or v marks a point on that pad's centre or on a via)
3V3REF  (via drill 0.6)
  Top 0.254: v68.07,25.27 68.01,25.21
  Top 0.305: 68.01,25.21 IC5.16 | v75.06,32.64 75.44,33.66 75.44,34.66
  Top 0.61: IC9.5 75.44,34.66 IC9.6 78.16,34.66 C38.1 | C47.1 75.03,32.66 v75.06,32.64
  Bottom 0.305: v68.07,25.27 72.77,29.97 72.77,30.73 74.68,32.64 v75.06,32.64
!MCLR  (via drill 0.6)
  Top 0.203: IC5.7 63.5,22.89
  Top 0.305: IC5.7 63.51,24.25 63.12,24.64 55.12,24.64 | IC1.10 38.48,24.64 39.88,26.04 47.88,26.04 | 52.88,42.67 ICD.1 52.94,42.8 52.07,42.8 51.44,42.16 v51.44,36.96 | v47.88,33.4 47.88,26.04 | 47.88,26.04 51.31,26.04 52.71,24.64 55.12,24.64 | R15.2 55.05,24.7 55.12,24.64
  Bottom 0.305: v51.44,36.96 v47.88,33.4
+3V3  (via drill 0.6, 0.6 pad 0.25, 1)  (16 unrouted)
  Top 0.254: IC5.10 65.01,25.73 C7.1
  Top 0.279: IC5.26 68.59,29.71 68.07,30.23 | 66.27,26.21 IC5.19 | 55.12,28.71 IC5.57
  Top 0.305: 68.07,30.23 v68.07,30.48 C6.1 | IC5.38 65.51,32.47 C5.1 65.91,32.06 | 55.07,28.32 55.37,28.7 55.12,28.71 | 65.91,30.23 65.91,30.1
  Top 0.406: R25.2 R26.2 R27.2 77.78,46.92 v77.09,46.23 | v71.37,46.23 55.56,46.23 C1.1
  Top 0.61: 55.37,28.7 55.12,28.62 | 65.34,29.53 65.09,29.27
  Top 0.813: 55.37,33.78 54.89,34.27 C20.1 49.95,34.6 49.78,34.6 49.66,34.73 49.66,37.21 | 55.37,33.78 55.37,28.7 | 65.09,29.27 C8.1 | 65.91,30.1 65.34,29.53 66.27,28.6 66.27,26.21 65.38,26.21 C7.1 | 65.91,32.06 65.91,30.23 68.07,30.23 | v60.45,29.21 60.45,32.38 59.06,33.78 55.37,33.78 | C1.1 54.98,45.64 54.98,44.2 | 54.98,44.2 ICD.2 | 54.98,44.2 54.85,44.32 51.18,44.32 50.42,43.56 50.42,38.48 49.66,37.72 49.66,37.21 | v32,43.56 34.8,43.56 35.81,42.55 35.81,40.64 C46.+ 39.24,37.21 | 49.66,37.21 39.24,37.21 | v38.61,31.5 38.61,36.58 39.24,37.21
  Bottom 0.406: v71.37,46.23 v77.09,46.23
  Bottom 0.813: IC6.OUT C18.1
  other vias: 65.02,25.78 65.91,32.13
+3V3_ENC  (via drill 0.6)  (7 unrouted)
  Top 0.61: v46.1,15.24 C14.1 | v46.1,15.24 46.1,14.99 | 46.1,14.99 IC1.25 | IC1.28 49.91,15.18 C13.1 | IC1.19 C11.1 38.55,15.24 39.75,15.24 | 39.75,15.24 IC1.20 | 39.75,15.24 40.57,15.24 C12.1 40.96,14.99 46.1,14.99 | IC1.15 33.4,15.11 v33.15,15.37 | v37.85,19.68 37.85,16 v38.48,15.37 | v49.78,15.24 v46.1,15.24
  Bottom 0.61: v38.48,15.37 36.26,15.37 | 36.26,15.37 FB1.1 | 36.26,15.37 v33.15,15.37 | v37.85,19.68 38.48,20.32 38.48,27.37 C26.1 38.54,28.45 FB7.2
  other vias: 40.64,15.24
+5V  (12 unrouted)
  Top 0.61: FB6.1 72.71,47.62 45.08,47.62
  Top 0.813: IC13.OUT 45.08,47.62 45.08,45.41 C43.1 46.55,45.15 46.86,44.83 46.86,41.17 C44.1
+9V  (via drill 0.6, 1)
  Top 0.254: IC7.2 77.15,28.83 C35.1
  Top 0.61: 81.92,29.85 80.9,28.83 IC7.2
  Top 0.813: 81.92,29.85 v81.92,37.08 | v77.47,48.13 76.71,48.9 49.66,48.9 v49.53,49.02 | IC10.3 20.7,36.2 20.7,37.02 | 20.7,45.72 20.7,46.48 20.57,46.61 TP1.TP | 20.7,45.72 20.7,37.02 | IC13.IN 40.01,46.86 38.74,45.59 | 37.97,45.59 38.74,45.59 | 37.97,45.59 26.92,45.59 | 26.92,45.59 20.83,45.59 20.7,45.72 | IC6.IN 26.85,45.66 26.92,45.59 | 26.92,45.59 26.92,44.77 C19.1 | 38.74,45.59 39.56,45.59 C16.1 | 20.7,37.02 24.57,37.02 C48.+ | v48.9,46.23 48.9,39.75 48.13,38.99 42.55,38.99 40.89,40.64 38.74,40.64 37.97,41.4 37.97,45.59
  Bottom 0.813: v77.47,48.13 81.92,43.69 v81.92,37.08 | v49.53,49.02 49.53,46.86 v48.9,46.23
AGND  (via drill 0.6)  (6 unrouted)
  Top 0.254: 67.5,12.51 v67.56,12.57
  Top 0.61: IC3.3 64.3,3.18 v64.9,3.18 | C32.2 77.16,11.62 76.96,11.81
  Top 0.686: C30.2 67.5,12.51
  Top 0.711: IC4.3 v73.28,7.37
  other vias: 80.65,22.48 59.94,11.18 59.56,13.34 75.44,11.81 80.77,19.81 84.33,2.03 76.2,6.22
  pour Bottom (isolate 0.406, no thermals): 75.56,22.86 89.28,22.86 89.28,-5.46 57.15,-5.33 57.15,19.18 72.01,19.18
AVCC  (via drill 0.6)  (6 unrouted)
  Top 0.61: FB4.1 v62.74,1.91 | FB5.2 82.93,20 | C34.1 82.74,14.22 | 82.74,14.22 82.74,9.71 v82.04,9.02 | v75.06,9.02 75.06,7.37 74.04,6.35 FB2.1 | C49.+ 82.61,14.35 82.74,14.22
  Top 0.686: 82.93,20 arc-90 C34.1
  Bottom 0.61: 73.72,3.87 arc90 v71.75,1.91 | v82.04,9.02 v75.06,9.02
  Bottom 0.686: FB2.1 73.72,3.87
  other vias: 74.04,3.81
CS_ETH  (1 unrouted)
  Top 0.305: IC1.9 39.75,19.56 40.01,19.3 61.21,19.3 64.01,22.1 64.01,22.9
CS_PGA1  (1 unrouted)
CS_PGA2  (1 unrouted)
CS_PGA3  (1 unrouted)
CS_REF1  (1 unrouted)
CS_REF2  (1 unrouted)
CS_REF3  (1 unrouted)
GND  (via drill 0.6, 0.6 pad 0.25, 1, 3.2)  (37 unrouted)
  Top 0.254: IC5.9 64.51,24.33 C7.2
  Top 0.279: IC5.25 68.64,29.21 C6.2 | IC5.20 68.29,26.71 68.07,27.05
  Top 0.305: IC5.41 64.01,32.2 C5.2 | C22.2 v62.74,43.43 | IC1.11 37.21,26.8 36.7,27.3 C26.2
  Top 0.61: IC1.22 IC1.21 41.02,10.92 v40.39,10.29 37.72,10.29 37.21,10.79 IC1.18 | v48.64,24.51 IC1.2 | 76.71,38.61 76.64,38.61 C37.2 | 76.71,38.61 v77.22,38.61 77.99,39.38 77.99,42.92 C36.2 | 76.71,38.61 76.01,38.55 IC9.1 IC9.2 | C35.2 77.15,27.12 77.98,26.29 IC7.4 80.65,26.29 R19.1 | C17.2 v20.57,7.62 20.57,7.37 | IC12.3 53.98,30.35 arc90 v53.72,30.61
  Top 0.813: C6.2 68.07,27.05 | v53.72,30.61 50.95,30.61 C20.2 | C19.2 29.28,42.74 v29.34,42.8 29.34,42.86 C18.2 | 43.84,43.25 C43.2 | 42.67,43.25 C16.2 | IC13.GND 42.54,43.38 42.67,43.25 | 42.67,43.25 43.84,43.25 | 43.84,43.25 C44.2
  Bottom 0.61: v36.7,27.43 36.58,27.56 | v29.34,8.13 29.34,6.1 | v48.64,24.51 47.75,25.15 47.75,24.89
  Bottom 0.711: C9.2 arc90 22.1,29.65 22.1,32.38 | 31.37,33.53 R10.1
  Bottom 0.813: v20.57,7.62 20.57,6.35
  other vias: 68.07,28.7 63.88,32.13 68.33,43.43 12.45,33.02 9.02,38.99 1.52,33.91 52.71,17.65 55.25,17.65 42.42,2.79 46.23,2.79 78.11,36.58 82.55,28.83 76.96,27.18 63.12,25.78 3.68,47.12 3.68,3.43 53.59,3.43 72.01,32.89 53.09,45.97
  pour Bottom (isolate 0.406, rank 2, no thermals): -0.76,51.69 -1.27,-0.63 187.71,-1.14 187.71,51.44
ICDC
  Top 0.229: IC5.48 54.91,35.01 52.96,36.96 52.96,38.75 ICD.5
ICDD
  Top 0.229: IC5.47 61.01,35.76 60.83,35.94 56.52,35.94 56.26,36.2 56.26,40.01 55.5,40.77 ICD.4
INT0  (via drill 0.6)
  Top 0.254: IC1.4 46.1,24.26 v45.85,24.51 | IC5.35 67.01,36.37 v66.93,36.45
  Bottom 0.254: v66.93,36.45 53.34,36.45 52.07,35.18 52.07,27.43 51.05,26.42 46.74,26.42 45.85,25.53 v45.85,24.51
LED0
  Top 0.254: IC5.27 76.43,30.21 78.49,32.26 79.76,32.26 81.03,33.53 81.03,37.46 81.66,38.1 85.47,38.1 85.73,38.35 LED0.C
LED1
  Top 0.254: IC5.28 76.17,30.71 78.23,32.77 79.5,32.77 80.52,33.78 80.52,37.85 81.28,38.61 83.44,38.61 83.69,38.86 LED1.C
LED2
  Top 0.254: IC5.29 75.91,31.21 77.98,33.27 79.25,33.27 80.01,34.04 80.01,38.13 LED2.C
N$1  (2 unrouted)
N$2  (2 unrouted)
N$5
  Top 0.61: IC2.15 21.97,17.27 23.5,15.75 R6.2
N$6  (via drill 0.6)  (2 unrouted)
  Top 0.61: v30.86,17.27 IC2.2 | R1.1 29.4,10.16 C3.1
  Bottom 0.61: FB1.2 36.13,17.27 v30.86,17.27 29.53,17.27 R2.1 29.21,12.77 R1.1
  other vias: 29.34,12.57
N$7
  Top 0.61: IC2.10 21.46,23.62 21.84,23.24 21.84,19.18 22.35,18.67 25.4,18.67 25.91,18.16 R7.2
N$8
  Bottom 0.61: C9.1 24.38,27.62 R3.1
  Bottom 0.686: R3.1 R4.1
N$9
  Top 0.61: R8.1 R9.1 13.81,6.86 17.27,6.86 17.91,7.49 17.91,8.89 18.6,9.59 C17.1 21.59,10.61 R6.1 R7.1
N$11  (4 unrouted)
N$12
  Top 0.61: IC9.3 | IC9.3 C37.1 74.11,41.85 C36.1 75.18,46.93 FB6.2 | IC9.4 IC9.3
N$13  (1 unrouted)
N$14  (via drill 0.6)  (2 unrouted)
  Bottom 0.61: J1.4 J1.5 10.7,15.88 10.7,12.19 11.59,11.3 R8.2
  other vias: 11.59,8.64
N$15  (via drill 0.6)  (2 unrouted)
  Bottom 0.61: J1.7 J1.8 13.75,12.57 R9.2
  other vias: 13.75,8.64
N$16
  Top 0.686: IC1.24 44.83,8.25 45.97,7.11 Q2.2 48.13,7.11 48.01,6.99 48.01,2.85 C25.1
N$17
  Top 0.686: IC1.23 43.56,8.13 42.55,7.11 Q2.1 40.39,7.11 40.39,2.86 C24.1
N$18
  Top 0.686: IC1.14 R10.2
N$19  (via drill 0.6)  (2 unrouted)
  other vias: 50.04,22.73
N$20  (2 unrouted)
N$21  (via drill 0.6)
  Top 0.686: IC3.7 60.11,7.37 IC3.8 59.09,5.08 v58.55,5.08
  Bottom 0.686: v58.55,5.08 59.44,4.19 C27.1 FB3.2
N$22
  Top 0.305: LED3.A R11.1
N$23
  Top 0.305: LED4.A R12.1
N$24
  Top 0.305: IC1.26 47.37,11.18 49.4,9.14 54.99,9.14 55.25,9.4 R11.2
N$25
  Top 0.305: R12.2 49.72,10.35 48.64,11.43 IC1.27
N$26  (1 unrouted)
  Top 0.686: 61.98,10.54 IC3.6 | C29.1 62.04,10.6
  Top 0.711: 62.04,10.6 61.98,10.54 | C29.1 62.1,11.24
N$27  (1 unrouted)
  Top 0.686: 65.6,12.57 C30.1 65.6,7.94 arc90 67.44,6.1 IC4.6
N$28  (via drill 0.6)  (1 unrouted)
  Top 0.305: v81.15,2.03 81.15,11.81 77.98,14.99 77.98,19.63 R18.1
  Bottom 0.61: v81.15,2.03 CONN1.T2
N$29  (via drill 0.6)  (2 unrouted)
  Top 0.61: v78.61,2.03 79.76,3.18 79.76,10.16 | 77.4,13.91 79.76,11.56 79.76,10.16 | 79.76,10.16 79.63,10.03 C32.1
  Bottom 0.61: v78.61,2.03 CONN1.T3
N$30  (2 unrouted)
N$31  (via drill 0.6)
  Top 0.254: R16.1 70.74,18.16
  Top 0.305: 70.74,18.16 v71.12,17.78 | v63.88,15.24 63.88,9.91 64.52,9.27 64.52,6.77 IC3.4
  Bottom 0.305: v71.12,17.78 71.12,17.53 69.34,15.75 64.39,15.75 v63.88,15.24
N$32  (via drill 0.6)  (1 unrouted)
  Top 0.686: C31.1 76.2,4.19 76.2,2.23 76.27,2.23 arc-90 v76.07,2.03
  Bottom 0.61: 76.01,1.97 76.01,1.33 CONN1.T4
  Bottom 0.686: FB2.2 76.01,1.97 v76.07,2.03
N$33  (via drill 0.6)  (1 unrouted)
  Top 0.406: v67.69,2.92 67.69,3.43 68.54,4.27
  Top 0.686: v65.91,4.83 IC4.7 68.54,4.27 68.58,4.23 IC4.8
  Bottom 0.406: FB4.2 68.71,1.91 v67.69,2.92
N$34  (via drill 0.6)  (2 unrouted)
  Top 0.61: IC7.6 83.06,27.56 v82.55,27.05 | FB5.1 82.93,25.65 82.55,26.04 C33.1
N$35
  Top 0.813: C40.+ 13.84,40.44 13.84,41.27 | 13.84,46.61 13.84,41.27 | 13.84,46.61 13.72,46.74 L1.2 | 13.84,41.27 IC10.1 | TP2.TP 13.84,46.61
N$40  (via drill 0.6)
  Top 0.305: IC4.4 69.85,13.97 v70.1,14.22 | v73.41,17.91 74.08,18.58 R17.1
  Bottom 0.305: v70.1,14.22 73.41,17.53 v73.41,17.91
N$41
  Top 0.813: 6.6,41.63 SUPP.2 | 6.6,41.63 6.6,33.92 D2.C 6.6,33.9 6.6,33.53 7.11,33.02 C39.+ | 6.6,41.63 7.62,42.67 L1.1
N$43  (2 unrouted)
N$46  (via drill 0.6)  (2 unrouted)
  Top 0.279: IC5.56 56.9,29.21 56.64,29.46 v56.64,30.61 C23.2
N$47
  Top 0.305: IC12.1 R15.1
N$48
  Top 0.305: IC5.40 64.51,37.85 62.99,39.37 Q1.2
  Top 0.61: Q1.2 59.94,42.61 C22.1
N$49
  Top 0.305: IC5.39 65.01,37.83 66.55,39.37 Q1.1 70.29,39.94
  Top 0.61: 70.29,39.94 C21.1
N$55  (1 unrouted)
N$56  (1 unrouted)
N$60
  Top 0.254: LED0.A R25.1
N$61
  Top 0.254: LED1.A R26.1
N$62
  Top 0.254: LED2.A R27.1
SCK
  Top 0.305: IC1.8 41.02,23.75 42.67,25.4 50.93,25.4 52.32,24 61.72,24 62.01,23.71 IC5.4
SDI  (6 unrouted)
  Top 0.203: IC5.5 62.48,22.88
  Top 0.305: IC1.6 43.56,21.34 44.32,20.57 60.83,20.57 62.51,22.25 IC5.5
SDO  (6 unrouted)
  Top 0.203: IC5.6 62.99,22.89
  Top 0.305: IC1.7 42.29,20.7 43.05,19.94 60.96,19.94 63.01,21.99 IC5.6
STX
  Top 0.305: R16.2 70.74,24.26 71.63,25.15 71.63,26.8 71.22,27.21 IC5.21
STY
  Top 0.305: R17.2 72.14,22.61 72.14,27.43 71.86,27.71 IC5.22
STZ
  Top 0.305: R18.2 72.64,24.97 72.64,27.81 72.25,28.21 IC5.23
TEMP  (via drill 0.6)  (1 unrouted)
  Top 0.305: IC5.12 66.01,24.36 v66.55,24.89 | IC7.3 78.87,27.56
  Bottom 0.305: v66.55,24.89 67.31,24.13 72.52,24.13 73.66,25.27 73.66,27.3 74.55,28.19 78.11,28.19
TPIN+1  (via drill 0.6)  (2 unrouted)
  Top 0.61: IC1.13 34.67,21.34 33.91,20.57 31.24,20.57 29.46,22.35 IC2.6 R4.2
  other vias: 26.29,22.35
TPIN+2
  Top 0.508: J1.3 12.22,20.57 14.13,22.48 17.78,22.48 17.91,22.35 IC2.11
TPIN-1  (via drill 0.6)  (2 unrouted)
  Top 0.61: IC1.12 35.94,24 35.05,24.89 IC2.8 R3.2
  other vias: 26.29,24.89
TPIN-2
  Top 0.508: IC2.9 10.57,24.89 10.06,24.38 10.06,16.76 10.7,16.13 J1.6
TPOUT+1
  Top 0.61: 31.62,12.57 31.62,10.92 32.26,10.29 35.43,10.29 35.94,10.79 IC1.17 | 31.62,12.57 31.62,15.49 31.12,16 IC2.1 | 31.62,12.57 R1.2
TPOUT+2
  Top 0.508: IC2.16 16.54,16 16.29,16.26 16.29,17.14 16.03,17.4 14,17.4 12.99,18.67 11.46,18.67 10.95,19.18 10.95,22.1 11.34,22.48 J1.1
TPOUT-1  (via drill 0.6)
  Top 0.61: IC2.3 v32.77,18.54 34.67,16.64 IC1.16
  Bottom 0.61: R2.2 32.45,18.86 v32.77,18.54
TPOUT-2
  Top 0.508: IC2.14 16.8,18.54 16.54,18.8 16.54,20.96 16.29,21.21 J1.2
X  (1 unrouted)
  Top 0.305: IC5.15 67.51,21.9 67.69,21.72
  Top 0.406: 67.69,21.72 68.45,21.72 68.71,21.46
XAMP  (2 unrouted)
XORG  (1 unrouted)
Y  (1 unrouted)
  Top 0.305: IC5.14 67.01,20.97
YAMP  (2 unrouted)
YORG  (1 unrouted)
Z  (1 unrouted)
  Top 0.305: IC5.13 66.51,22.19 66.29,21.97
  Top 0.406: 66.29,21.97 65.15,21.97 64.64,21.46
ZAMP  (2 unrouted)
ZORG  (1 unrouted)
(copper drawn outside any net)
  shapes: Bottom area x1